# EasyEDA schematic HW1_52.json
TITLE: Sheet_1; REV: 1.0; Date: 2020-11-04; Sheet: 1/1; Drawn By: gokbeykeskin_4066; Company: Your Company
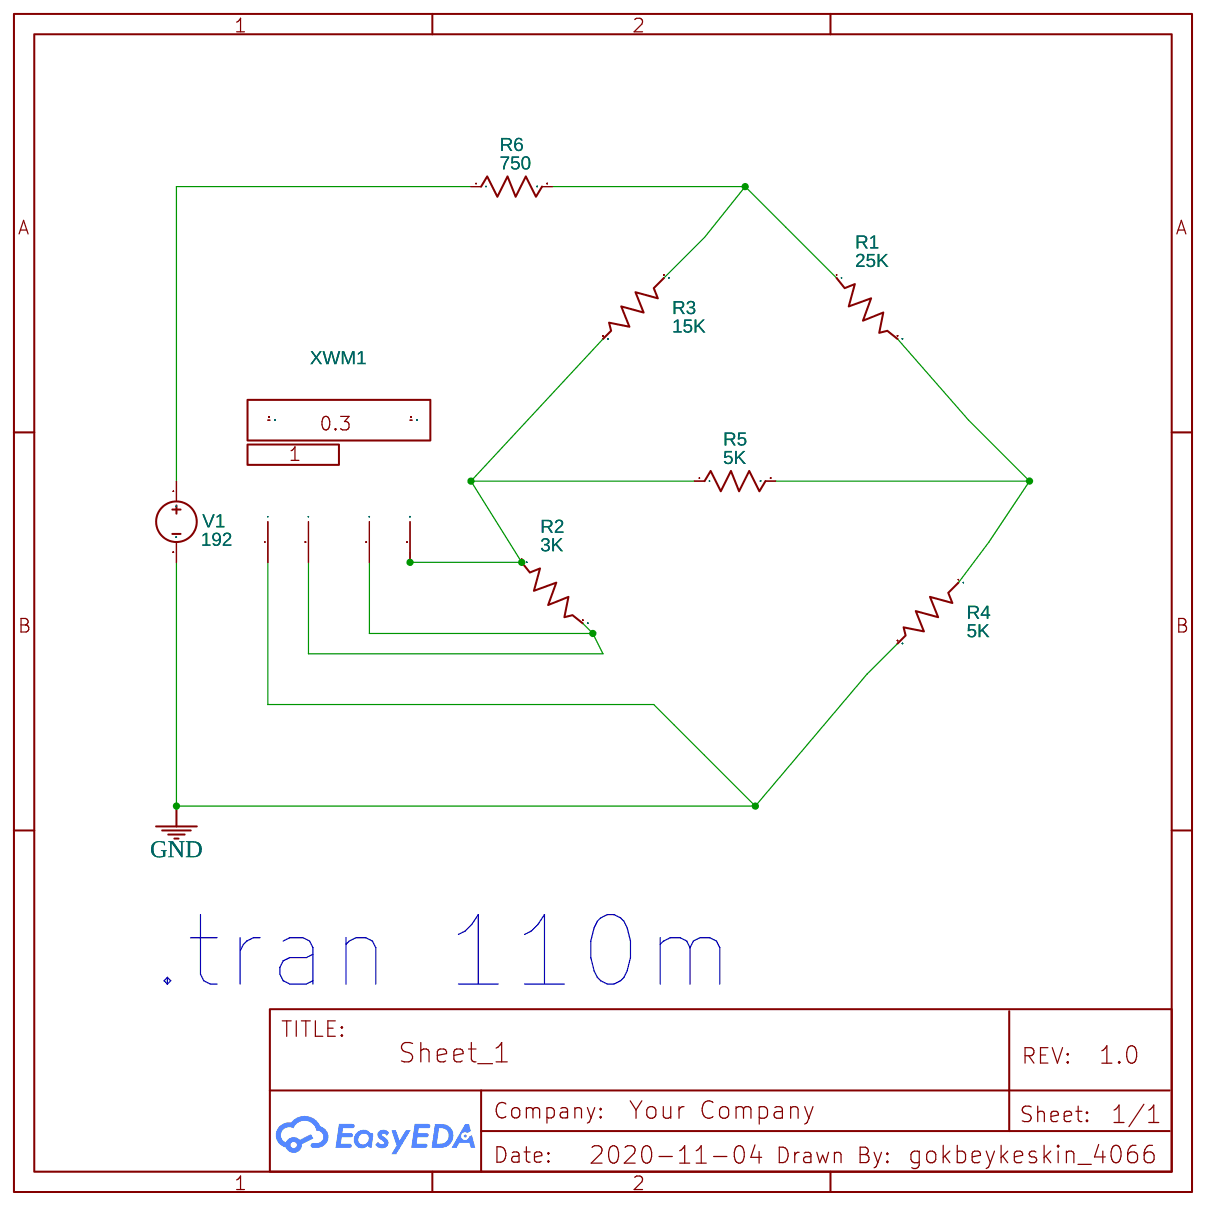
[diagram p0: schematic sheet]

## Parts
R1  25K  [AXIAL-0.3]
R2  3K  [AXIAL-0.3]
R3  15K  [AXIAL-0.3]
R4  5K  [AXIAL-0.3]
R5  5K  [AXIAL-0.3]
R6  750  [AXIAL-0.3]
V1  192  [HDR1X2]
XWM1  Wattmeter

## Library data of the parts
R1-R4 = Resistor_45Degree_US: Supplier: YUJING; Contributor: EasyEDA; Resistance: 1K
R5 R6 = Resistor_US: Resistance: 1k; Contributor: EasyEDA; Supplier: YUJING
V1 = VDC: Contributor: EasyEDA; sim: true
XWM1 = WATTMETER: Contributor: EasyEDA; NameDisplay: 0; sim: true

## Nets
GND: R4.2 V1.2 XWM1.4(I-)
Net-(R1-1): R1.1 R3.1 R6.2
Net-(R1-2): R1.2 R4.1 R5.2
Net-(R2-1): R2.1 R3.2 R5.1 XWM1.1(V+)
Net-(R2-2): R2.2 XWM1.2(V-) XWM1.3(I+)
Net-(R6-1): R6.1 V1.1

Not connected (* = marked no-connect by the designer): XWM1 P PF

## Notes on the sheet
- .tran 110m
